# Altium schematic sheet Power Supply.SchDoc
size A4; SheetNumber: 2; SheetTotal: 6
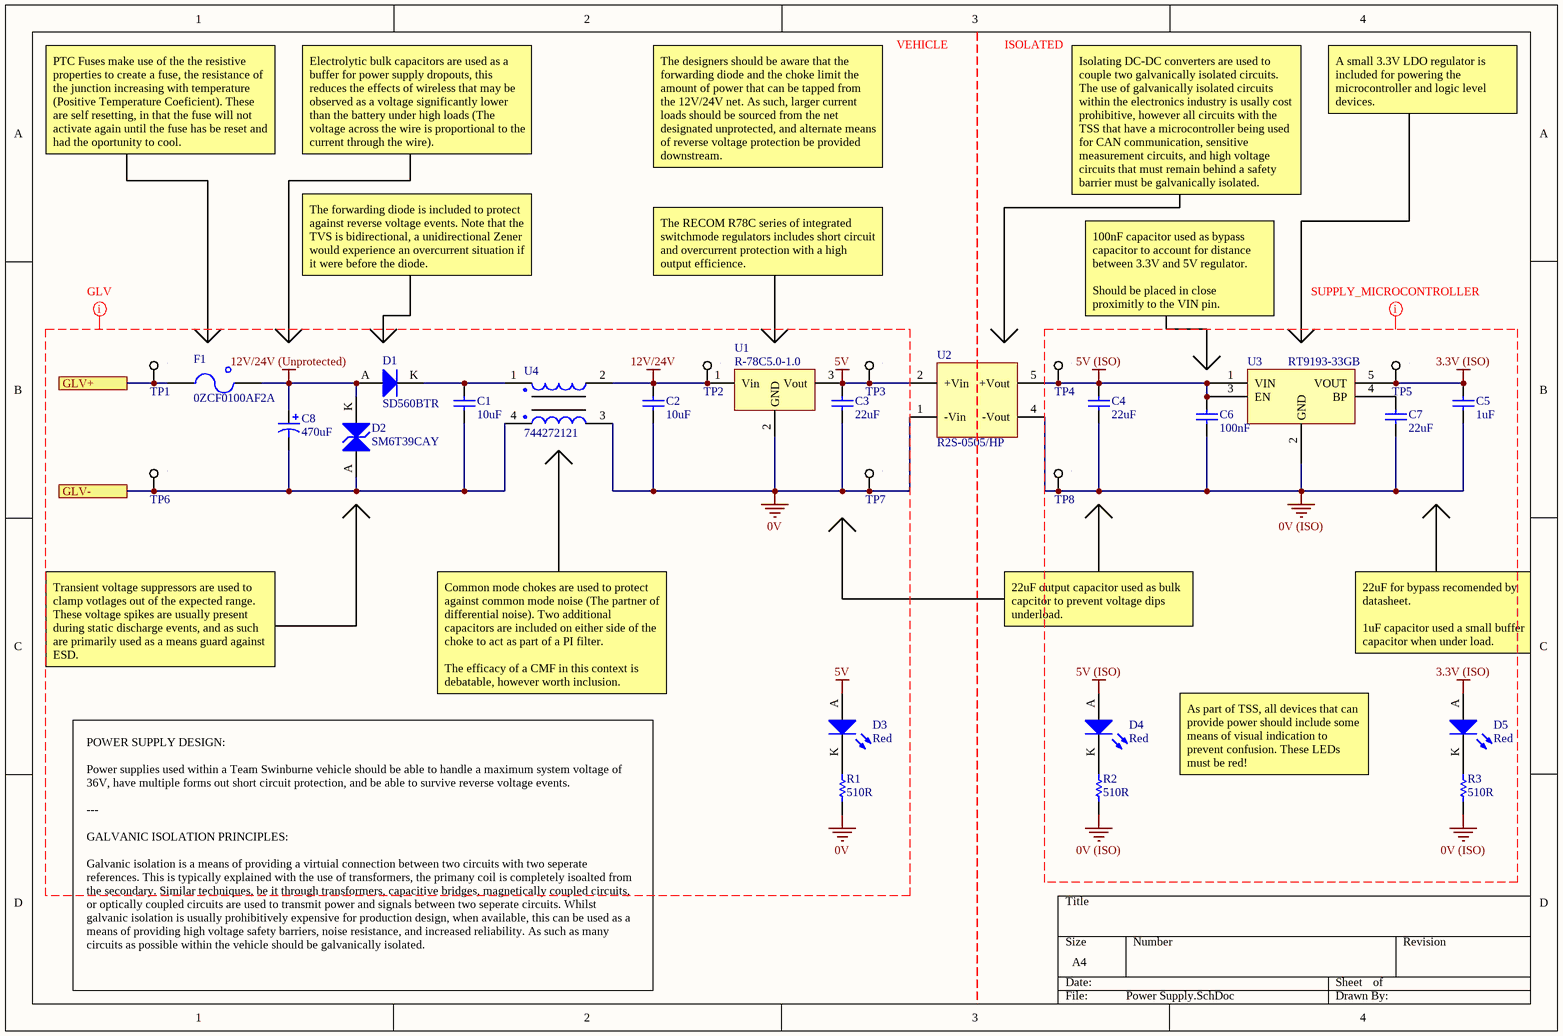
[diagram p0: Power Supply.SchDoc]

## Parts
C1  10uF  [0805]
C2  10uF  [0805]
C3  22uF  [1206]
C4  22uF  [1206]
C5  1uF  [0805]
C6  100nF  [0805]
C7  22uF  [1206]
C8  470uF  [Vishay Radial 1616]
D1  SD560BTR  [SMB Diode]
D2  SM6T39CAY  [ST SMB Diode]
D3  Red  [0805 LED]
D4  Red  [0805 LED]
D5  Red  [0805 LED]
F1  0ZCF0100AF2A  [2920]
R1  510R  [0805]
R2  510R  [0805]
R3  510R  [0805]
TP1  0mm  [SMD Test Point 1mm]  (value not drawn)
TP2  0mm  [SMD Test Point 1mm]  (value not drawn)
TP3  0mm  [SMD Test Point 1mm]  (value not drawn)
TP4  0mm  [SMD Test Point 1mm]  (value not drawn)
TP5  0mm  [SMD Test Point 1mm]  (value not drawn)
TP6  0mm  [SMD Test Point 1mm]  (value not drawn)
TP7  0mm  [SMD Test Point 1mm]  (value not drawn)
TP8  0mm  [SMD Test Point 1mm]  (value not drawn)
U1  R-78C5.0-1.0  [RECOM 3-SIP]
U2  R2S-0505/HP  [RECOM 8-SMD (5 Pin)]
U3  RT9193-33GB  [RICHTEK SOT-23-5]
U4  744272121  [Wurth 4-PC Pad]

## Ports
GLV+, GLV-

## Nets
0V: C2.1 C3.1 R1.1 TP7.1 U1.2(GND) U2.1(-Vin) U4.3
0V (ISO): C4.1 C5.1 C6.1 C7.1 R2.1 R3.1 TP8.1 U2.4(-Vout) U3.2(GND)
3.3V (ISO): C5.2 D5.A TP5.1 U3.5(VOUT)
5V: C3.2 D3.A TP3.1 U1.3(Vout) U2.2(+Vin)
5V (ISO): C4.2 C6.2 D4.A TP4.1 U2.5(+Vout) U3.1(VIN) U3.3(EN)
12V/24V: C2.2 TP2.1 U1.1(Vin) U4.2
12V/24V (Unprotected): C8.2 D1.A D2.K F1.2
GLV+: F1.1 TP1.1 ; port GLV+
GLV-: C1.1 C8.1 D2.A TP6.1 U4.4 ; port GLV-
NetC1_2: C1.2 D1.K U4.1
NetC7_2: C7.2 U3.4(BP)
NetD3_K: D3.K R1.2
NetD4_K: D4.K R2.2
NetD5_K: D5.K R3.2

## Layout directives
net class GLV: 0V, 5V, 12V/24V, 12V/24V (Unprotected)
net class MICROCONTROLLER: 0V (ISO), 3.3V (ISO), 5V (ISO)

## Notes on the sheet
- VEHICLE
- ISOLATED
- A small 3.3V LDO regulator is included for powering the microcontroller and logic level devices.
- PTC Fuses make use of the the resistive properties to create a fuse, the resistance of the junction increasing with temperature (Positive Temperature Coeficient). These are self resetting, in that the fuse will not activate again until the fuse has be reset and had the oportunity to cool.
- Electrolytic bulk capacitors are used as a buffer for power supply dropouts, this reduces the effects of wireless that may be observed as a voltage significantly lower than the battery under high loads (The voltage across the wire is proportional to the current through the wire).
- The designers should be aware that the forwarding diode and the choke limit the amount of power that can be tapped from the 12V/24V net. As such, larger current loads should be sourced from the net designated unprotected, and alternate means of reverse voltage protection be provided downstream.
- Isolating DC-DC converters are used to couple two galvanically isolated circuits.
  The use of galvanically isolated circuits within the electronics industry is usally cost prohibitive, however all circuits with the TSS that have a microcontroller being used for CAN communication, sensitive measurement circuits, and high voltage circuits that must remain behind a safety barrier must be galvanically isolated.
- The forwarding diode is included to protect against reverse voltage events. Note that the TVS is bidirectional, a unidirectional Zener would experience an overcurrent situation if it were before the diode.
- The RECOM R78C series of integrated switchmode regulators includes short circuit and overcurrent protection with a high output efficience.
- 100nF capacitor used as bypass capacitor to account for distance between 3.3V and 5V regulator.
  Should be placed in close proximitly to the VIN pin.
- 22uF output capacitor used as bulk capcitor to prevent voltage dips underload.
- 22uF for bypass recomended by datasheet.
  1uF capacitor used a small buffer capacitor when under load.
- Transient voltage suppressors are used to clamp votlages out of the expected range. These voltage spikes are usually present during static discharge events, and as such are primarily used as a means guard against ESD.
- Common mode chokes are used to protect against common mode noise (The partner of differential noise). Two additional capacitors are included on either side of the choke to act as part of a PI filter.
  The efficacy of a CMF in this context is debatable, however worth inclusion.
- As part of TSS, all devices that can provide power should include some means of visual indication to prevent confusion. These LEDs must be red!
- POWER SUPPLY DESIGN:
  Power supplies used within a Team Swinburne vehicle should be able to handle a maximum system voltage of 36V, have multiple forms out short circuit protection, and be able to survive reverse voltage events.
  ---
  GALVANIC ISOLATION PRINCIPLES:
  Galvanic isolation is a means of providing a virtuial connection between two circuits with two seperate references. This is typically explained with the use of transformers, the primany coil is completely isoalted from the secondary. Similar techniques, be it through transformers, capacitive bridges, magnetically coupled circuits, or optically coupled circuits are used to transmit power and signals between two seperate circuits. Whilst galvanic isolation is usually prohibitively expensive for production design, when available, this can be used as a means of providing high voltage safety barriers, noise resistance, and increased reliability. As such as many circuits as possible within the vehicle should be galvanically isolated.

## Library data of the parts
C1 C2 = GRM21BR6YA106KE43L: Manufacturer: muRata; Tolerance: 10%; Material: X5R; Rated Voltage: 50V; Part Number: GRM21BR6YA106KE43L; Value: 10uF; Digikey Part Number: 490-10514-6-ND
C3 C4 C7 = CC1206MKX5R7BB226: Manufacturer: YAGEO; Tolerance: 20%; Material: Ceramic; Rated Voltage: 16V; Part Number: CC1206MKX5R7BB226; Value: 22uF; Digikey Part Number: 311-1997-2-ND
C5 = AC0805KKX7R8BB105: Manufacturer: YAGEO; Tolerance: 10%; Material: X7R; Rated Voltage: 25V; Part Number: AC0805KKX7R8BB105; Value: 1uF; Digikey Part Number: DO NOT USE FOR NEW DESIGNS
C6 = GCM21BR71E104KA37L: Manufacturer: muRata; Tolerance: 10%; Material: X7R; Rated Voltage: 25V; Part Number: GCM21BR71E104KA37L; Value: 100nF; Digikey Part Number: DO NOT USE FOR NEW DESIGNS
C8 = MAL214699108E3: Manufacturer: Vishay; Tolerance: 20%; Material: Aluminium Electrolytic; Rated Voltage: 50V; Part Number: MAL214699108E3; Value: 470uF; Digikey Part Number: 4442PHCT-ND
D1 = SD560BTR: 1.2V_F 600V 5A SMB; Manufacturer: SMC Diode Solutions; Part Number: SD560BTR; Digikey Part Number: 1655-1530-2-ND; Digikey Link: https://www.digikey.com/product-detail/en/smc-diode-solutions/SD560BTR/1655-1530-2-ND/6022620
D2 = SM6T39CAY: 42.8V Clamp 93A (8/20µs) Ipp Tvs Diode Surface Mount SMB (DO-214AA); Manufacturer: ST; Vf: 42.8; Part Number: SM6T39CAY; Vbr: 42.8V; Digikey Part Number: SM6T39CAY; Digikey Link: https://www.digikey.com/en/products/detail/stmicroelectronics/SM6T39CAY/2442903; Alternative Parts: https://www.digikey.com/en/products/detail/stmicroelectronics/SM6T39AY/2442901
D3-D5 = SML-210LTT86: Red LED Indication - Discrete 1.75V 0805 (2012 Metric); Manufacturer: ROHM Semiconductor; Part Number: SML-210LTT86; Colour: Red; Digikey Part Number: 511-1286-1-ND; Digikey Link: https://www.digikey.com/product-detail/en/rohm-semiconductor/SML-210LTT86/511-1286-1-ND/637099
F1 = 0ZCF0100AF2A: PTC RESET FUSE 60V 1A 292; Manufacturer: Littelfuse Inc.; Part Number: 0ZCF0100AF2A; Digikey Part Number: 507-2070-1-ND; Digikey Link: https://www.digikey.com/product-detail/en/bel-fuse-inc/0ZCF0100AF2A/507-2070-1-ND/6210547
R1-R3 = RC0805FR07510RL: Manufacturer: YAGEO; Tolerance: 0.01; Rated Voltage: 0.125W; Part Number: RC0805FR07510RL; Value: 510R; Material: FR-07; Digikey Part Number: 311-510CRCT-ND
TP1-TP8 = SMD Test Point Small: Positions: 1; Row Spacing: 0; Flange: No; Contact: NA; Part Number: SMD Test Point Small; Pitch: 0mm; Angle: 0
U1 = R-78C5.0-1.0: CONV DC/DC 1A 5V OUT SIP VERT; Manufacturer: Recom; Isolation: Non-Isolated; Output Power: 5W; Part Number: R-78C5.0-1.0; Digikey Part Number: 945-1395-5-ND; Digikey Link: https://www.digikey.com.au/product-detail/en/recom-power/R-78C5.0-1.0/945-1395-5-ND/2652148; Output Voltage: 5V
U2 = R2S-0505/HP: Isolated Module DC DC Converter 1 Output 3.3V 606mA 4.5V - 5.5V Input; Manufacturer: Recom; Output Voltage: 5V; Output Power: 2W; Efficiency: 0.85; Part Number: R2S-0505/HP; Input Voltage: 4.5V-5.5V; Isolation: Isolated; Digikey Part Number: 945-1764-5-ND; Digikey Link: https://www.digikey.com/product-detail/en/recom-power/R2S-0505-HP/945-1764-5-ND/2302761
U3 = RT9193-33GB: Linear Voltage Regulator IC 1 Output 300mA SOT-23-5; Manufacturer: Richtek; Input Voltage: 5.5V-0.3V; Output Voltage: 3.3V; Output Power: 1W; Efficiency: 0.5; Isolation: Non-Isolated; Part Number: RT9193-33GB; Digikey Part Number: 1028-1014-1-ND; Digikey Link: https://www.digikey.com/products/en?keywords=1028-1014-1-ND
U4 = 744272121: 120µH @ 100kHz 2 Line Common Mode Choke Surface Mount 460 Ohms @ 30MHz 2.5A DCR 25mOhm; Manufacturer: Wurth Electronics Inc; Value: 120uH @ 100kHz; Part Number: 744272121; Impedence: 460 Ohms @ 30MHz; Material: Wirewound; Rated Current: 2.5A; Digikey Part Number: 732-1489-1-ND; Digikey Link: https://www.digikey.com/product-detail/en/w-rth-elektronik/744272121/732-1489-1-ND/1639501